# EAGLE design pro-radio (EAGLE 5.10)
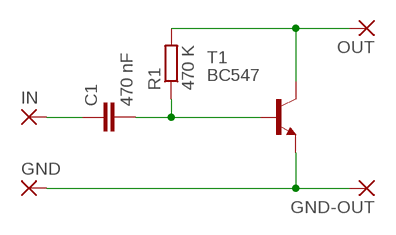
[diagram p0: schematic, sheet 1]

## Parts
C1  470 nF  C-EU075-032X103  [C075-032X103]
GND  2,15/1,0  [2,15/1,0]
GND-OUT  2,15/1,0  [2,15/1,0]
IN  2,15/1,0  [2,15/1,0]
OUT  2,15/1,0  [2,15/1,0]
R1  470 K  R-EU_0207/10  [0207/10]
T1  BC547  [TO92]

## Nets
GND-OUT: GND-OUT.1(P) GND.1(P) T1.1(E)
N$1: C1.1 IN.1(P)
N$2: C1.2 R1.1 T1.2(B)
N$3: OUT.1(P) R1.2 T1.3(C)

## Library data of the parts
C1 = rcl:C-EU: CAPACITOR, European symbol
GND GND-OUT IN OUT = wirepad:2,15/1,0: THROUGH-HOLE PAD
R1 = resistor:R-EU_: RESISTOR, European symbol
T1 = transistor:BC547: NPN TRANSISTOR

## Board
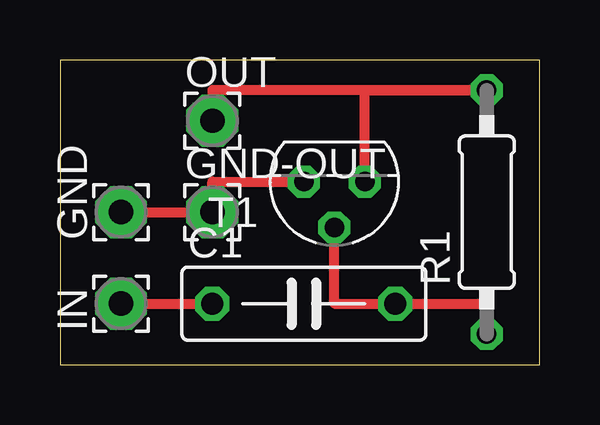
[diagram p1: board, top side]

Size 19.99 x 12.69 mm. Coordinates in mm from the lower left corner, seen from the top.
Outline: 0,0 19.99,0 19.99,12.69 0,12.69 0,0
Copper layers 1: Top 0.035mm
Design rules "default *": minimum track width 10mil, minimum drill 24mil, track to track 8mil, track to pad 8mil, pad to pad 8mil, via to via 8mil, smd to smd 8mil, copper to edge 40mil, drill to drill 8mil, minimum pad ring 10mil, minimum via ring 8mil, stop-mask expansion 4mil, vias tented up to drill 0mil, thermal gap 10mil

### Footprints (pad centres in the part's own frame; a part is rotated, then mirrored left to right if it is on the bottom)
C075-032X103 = drill 0.914 octagon: 1 -3.81,0; 2 3.81,0
2,15/1,0 = drill 1.016 pad 2.159 octagon: 1 0,0
0207/10 = drill 0.813 octagon: 1 -5.08,0; 2 5.08,0
TO92 = drill 0.813 octagon: 1 1.27,0; 2 0,1.905; 3 -1.27,0

### Placement (x,y rotation side)
C1  10.16,2.54 0 top
GND  2.54,6.35 90 top
GND-OUT  6.35,6.35 0 top
IN  2.54,2.54 90 top
OUT  6.35,10.16 0 top
R1  17.78,6.35 90 top
T1  11.43,7.62 180 top

### Tracks (layer width: path | path; a pad name or v marks a point on that pad's centre or on a via)
GND-OUT
  Top 0.406: GND.1 GND-OUT.1 6.35,7.62 T1.1
N$1
  Top 0.406: IN.1 C1.1
N$2
  Top 0.406: T1.2 11.43,2.54 C1.2 17.78,2.54 R1.1
N$3
  Top 0.406: T1.3 12.7,11.43 R1.2 6.35,11.43 OUT.1